# EAGLE board CrackberryPi_1.0.4 (EAGLE 6.5.0)
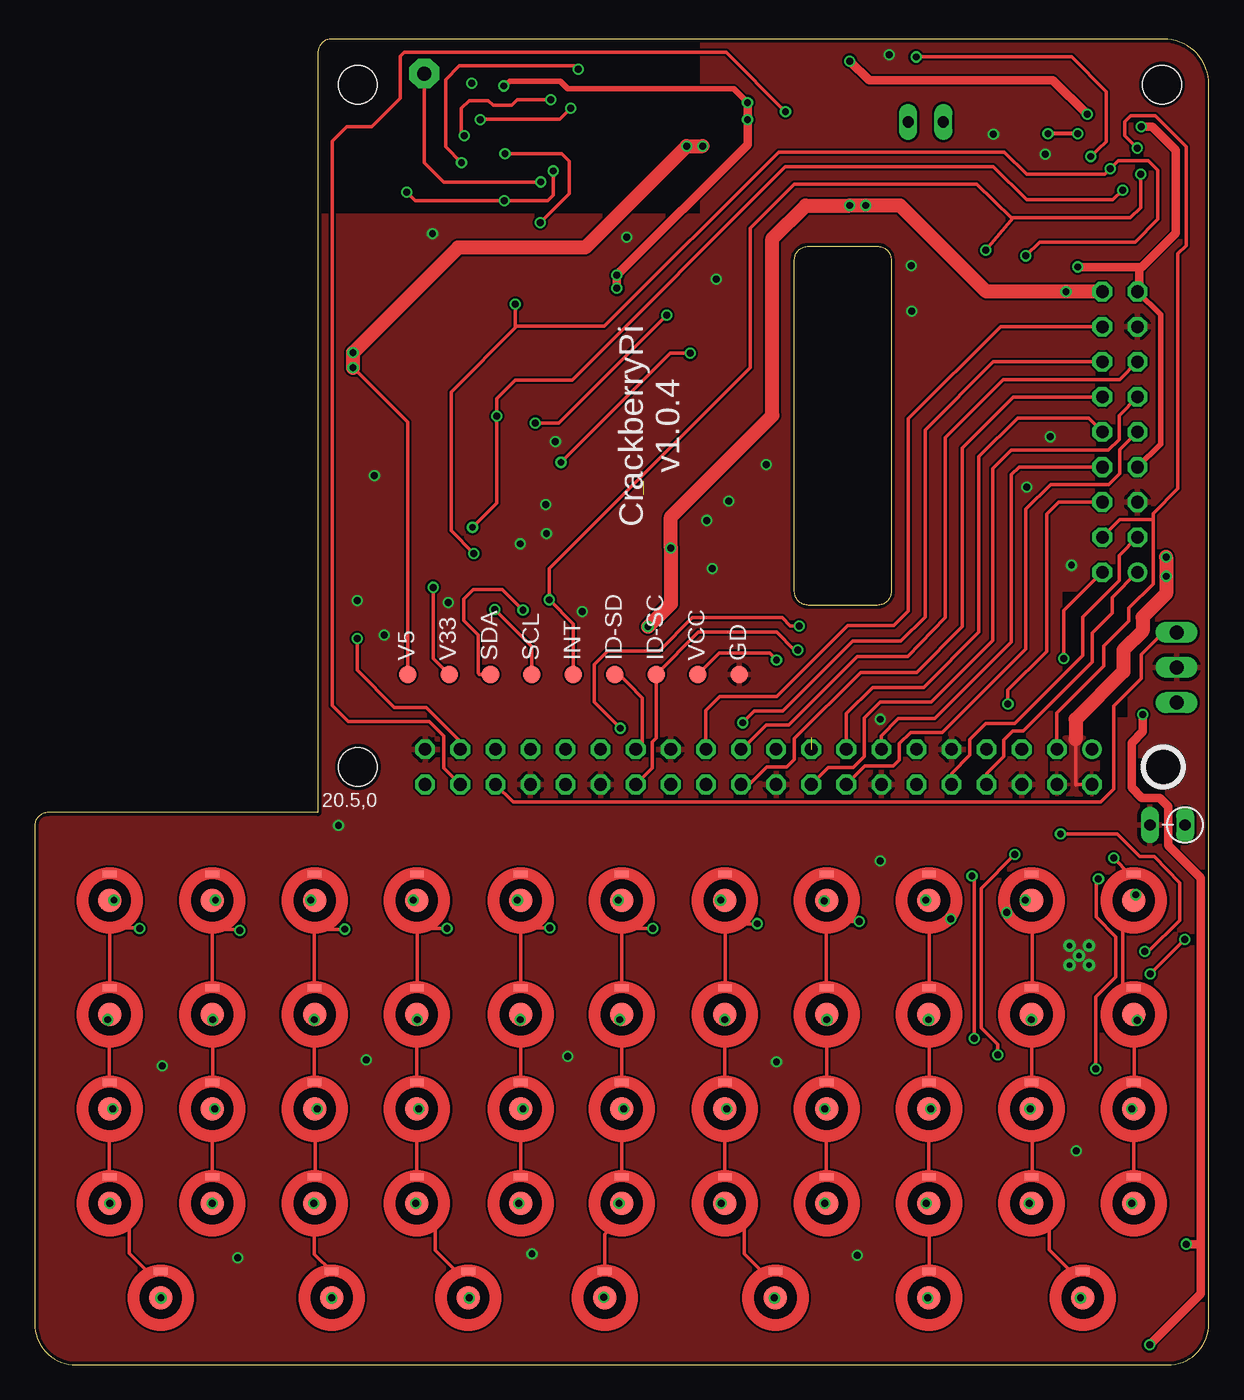
[diagram p5: board, top side]
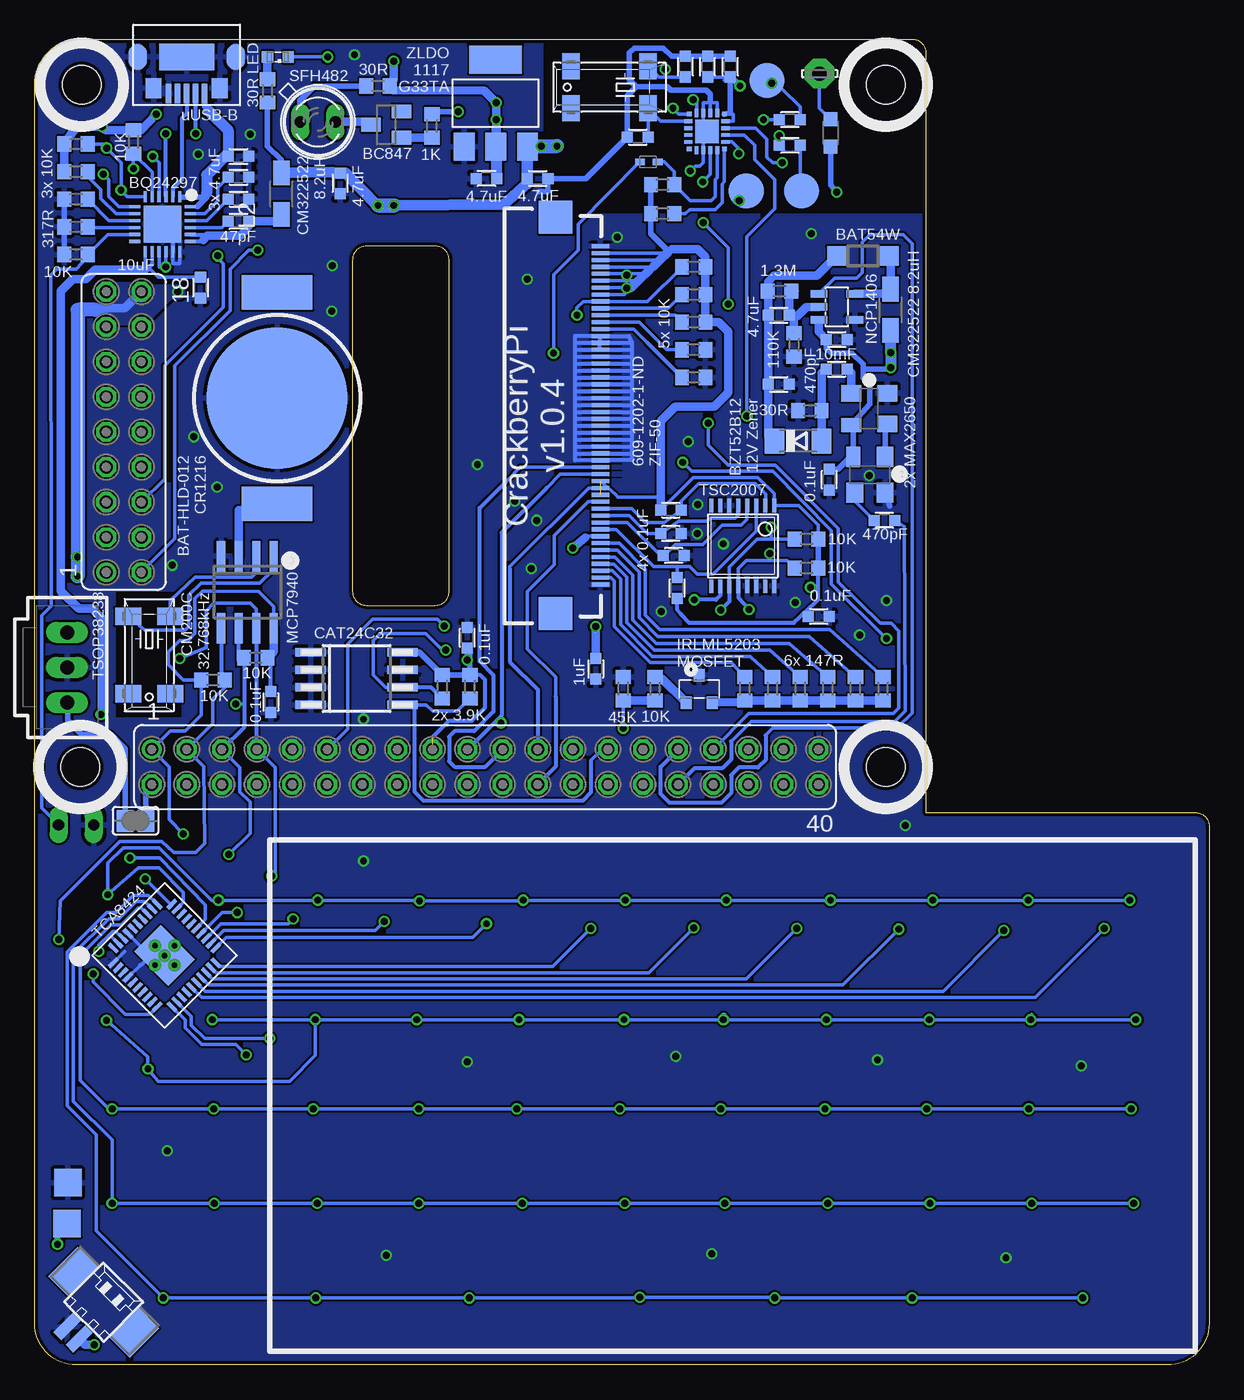
[diagram p6: board, bottom side, seen from below]

Size 85 x 96 mm. Coordinates in mm from the lower left corner, seen from the top.
Outline: 0,39 0,3 arc90 3,0 82,0 arc90 85,3 85,92.7 arc90 81.7,96 21.5,96 arc90 20.5,95 20.5,40 1,40 arc90 0,39
Outline: 56,81 61,81 arc-90 62,80 62,56 arc-90 61,55 56,55 arc-90 55,56 55,80 arc-90 56,81
Copper layers (1*16): Top 0.035mm / dielectric 1.5mm / Bottom 0.035mm
Design rules "SeeedStudio_2layer_DRU_no_angle_20140221": minimum track width 6mil, minimum drill 12mil, track to track 6mil, track to pad 6mil, pad to pad 6mil, via to via 6mil, smd to smd 0mil, copper to edge 10mil, drill to drill 10mil, minimum pad ring 10mil, minimum via ring 6mil, stop-mask expansion 2mil, vias tented up to drill 100mil, thermal gap 10mil
Holes 2.8 mm at 81.7,43.3 81.6,92.7 23.4,92.7 23.4,43.3
bKeepout: area 33,55.7 to 33.2,56.9
tRestrict: area 20.5,83.4 to 48.2,95.7; area 74.4,46.9 to 79.1,56
bRestrict: area 42.5,73.2 to 45.4,73.3; area 42.5,72.7 to 45.4,72.8; area 42.5,72.2 to 45.4,72.3; area 42.5,71.7 to 45.4,71.8; area 42.5,71.2 to 45.4,71.3; area 42.5,70.7 to 45.4,70.8; area 42.5,70.2 to 45.4,70.3; area 42.5,69.7 to 45.4,69.8; area 42.5,69.2 to 45.4,69.3; area 42.5,68.7 to 45.4,68.8; area 42.5,68.2 to 45.4,68.3; area 42.5,67.7 to 45.4,67.8; 14 more areas

## Footprints (pad centres in the part's own frame; a part is rotated, then mirrored left to right if it is on the bottom)
4MM = smd 1.7 x 1.7: IN 0,0 | smd 1 x 0.5: OUT 0,1.9
LSP10 = drill 1.016 pad 2.159 octagon: MP 0,0
B2,54 = smd 2.54 x 2.54: TP 0,0
C0603 = smd 0.8 x 0.8: 1 -0.75,0; 2 0.75,0
SOD123 = smd 1.4 x 1.4: A 1.9,0; C -1.9,0
SOD523 = smd 0.7 x 0.5: A 0.7,0; C -0.6,0
SOD80C = smd 1.4 x 1.8: A 1.7,0; C -1.7,0
SFH482 = drill 0.813 long: A -1.27,0; K 1.27,0
B1,27 = smd 1.27 x 1.27: TP 0,0
SOT223 = smd 1.499 x 2.007: 1 -2.261,-3.15; 2 0.025,-3.15; 3 2.311,-3.15 | smd 3.81 x 2.007: 4 0,3.15
SO-08M = smd 0.6 x 2.2: 1 -1.905,-3.33; 2 -0.635,-3.33; 3 0.635,-3.33; 4 1.905,-3.33; 5 1.905,3.33; 6 0.635,3.33; 7 -0.635,3.33; 8 -1.905,3.33
R1206W = smd 1.8 x 1.2: 1 -1.499,0; 2 1.499,0
L2012C = smd 1 x 1: 1 -1,0; 2 1,0
SML0603 = smd 0.8 x 0.8: A 0.75,0; C -0.75,0
MICRO3 = smd 0.8 x 0.9: 1 -0.95,-1; 2 0.95,-1; 3 0,1
MM20SS = smd 1.27 x 1.88: 1 -2.794,-1.524; 2 2.794,-1.524; 3 2.794,1.524; 4 -2.794,1.524
R0603 = smd 1 x 1.1: 1 -0.85,0; 2 0.85,0
RS-2,5 = drill 0.813 long: 1 -1.27,0; 2 1.27,0
SJ = smd 1.168 x 1.6: 1 -0.762,0; 2 0.762,0
FE20-2 = drill 0.914: 1 -24.13,1.27 | drill 0.914 octagon: 2 -24.13,-1.27; 3 -21.59,1.27; 4 -21.59,-1.27; 5 -19.05,1.27; 6 -19.05,-1.27; 7 -16.51,1.27; 8 -16.51,-1.27; 9 -13.97,1.27; 10 -13.97,-1.27; 11 -11.43,1.27; 12 -11.43,-1.27; 13 -8.89,1.27; 14 -8.89,-1.27; 15 -6.35,1.27; 16 -6.35,-1.27; 17 -3.81,1.27; 18 -3.81,-1.27; 19 -1.27,1.27; 20 -1.27,-1.27; 21 1.27,1.27; 22 1.27,-1.27; 23 3.81,1.27; 24 3.81,-1.27; 25 6.35,1.27; 26 6.35,-1.27; 27 8.89,1.27; 28 8.89,-1.27; 29 11.43,1.27; 30 11.43,-1.27; 31 13.97,1.27; 32 13.97,-1.27; 33 16.51,1.27; 34 16.51,-1.27; 35 19.05,1.27; 36 19.05,-1.27; 37 21.59,1.27; 38 21.59,-1.27; 39 24.13,1.27; 40 24.13,-1.27
FE09-2 = drill 0.914: 1 -10.16,1.27 | drill 0.914 octagon: 2 -10.16,-1.27; 3 -7.62,1.27; 4 -7.62,-1.27; 5 -5.08,1.27; 6 -5.08,-1.27; 7 -2.54,1.27; 8 -2.54,-1.27; 9 0,1.27; 10 0,-1.27; 11 2.54,1.27; 12 2.54,-1.27; 13 5.08,1.27; 14 5.08,-1.27; 15 7.62,1.27; 16 7.62,-1.27; 17 10.16,1.27; 18 10.16,-1.27
SOT23 = smd 1 x 1.4: 1 -0.95,-1.1; 2 0.95,-1.1; 3 0,1.1
TP20SQ = smd 2 x 2: TP 0,0
VQFN-4X4-24 = smd 0.8 x 0.23: 1 -2,1.25; 2 -2,0.75; 3 -2,0.25; 4 -2,-0.25; 5 -2,-0.75; 6 -2,-1.25; 13 2,-1.25; 14 2,-0.75; 15 2,-0.25; 16 2,0.25; 17 2,0.75; 18 2,1.25 | smd 0.23 x 0.8: 7 -1.25,-2; 8 -0.75,-2; 9 -0.25,-2; 10 0.25,-2; 11 0.75,-2; 12 1.25,-2; 19 1.25,2; 20 0.75,2; 21 0.25,2; 22 -0.25,2; 23 -0.75,2; 24 -1.25,2 | smd 2.7 x 2.7: P$1 0,0
SOT23-5L = smd 0.55 x 1.2: 1 -0.95,-1.3; 2 0,-1.3; 3 0.95,-1.3; 4 0.95,1.3; 5 -0.95,1.3
SOT143-W = smd 1.2 x 1.45: 1 -1.1,-1.3; 2 -1.1,1.3; 3 1.1,1.3 | smd 1 x 1.45: 4 1.2,-1.3
CR1216 = smd 2.5 x 5.1: + -7.65,0; P$2 7.65,0 | smd 10.2 x 10.2: GND 0,0
SO08 = smd 0.6 x 2.2: 1 -1.905,-2.6; 2 -0.635,-2.6; 3 0.635,-2.6; 4 1.905,-2.6; 5 1.905,2.6; 6 0.635,2.6; 7 -0.635,2.6; 8 -1.905,2.6
TSSOP16 = smd 0.305 x 0.991: 1 -2.275,-2.918; 2 -1.625,-2.918; 3 -0.975,-2.918; 4 -0.325,-2.918; 5 0.325,-2.918; 6 0.975,-2.918; 7 1.625,-2.918; 8 2.275,-2.918; 9 2.275,2.918; 10 1.625,2.918; 11 0.975,2.918; 12 0.325,2.918; 13 -0.325,2.918; 14 -0.975,2.918; 15 -1.625,2.918; 16 -2.275,2.918
QFN40 = smd 0.85 x 0.28: 1 -3,2.25; 2 -3,1.75; 3 -3,1.25; 4 -3,0.75; 5 -3,0.25; 6 -3,-0.25; 7 -3,-0.75; 8 -3,-1.25; 9 -3,-1.75; 10 -3,-2.25; 21 3,-2.25; 22 3,-1.75; 23 3,-1.25; 24 3,-0.75; 25 3,-0.25; 26 3,0.25; 27 3,0.75; 28 3,1.25; 29 3,1.75; 30 3,2.25 | smd 0.28 x 0.85: 11 -2.25,-3; 12 -1.75,-3; 13 -1.25,-3; 14 -0.75,-3; 15 -0.25,-3; 16 0.25,-3; 17 0.75,-3; 18 1.25,-3; 19 1.75,-3; 20 2.25,-3; 31 2.25,3; 32 1.75,3; 33 1.25,3; 34 0.75,3; 35 0.25,3; 36 -0.25,3; 37 -0.75,3; 38 -1.25,3; 39 -1.75,3; 40 -2.25,3 | smd 2.7 x 3.5: P$2 0,0 | smd 1 x 1.5: P$11 -0.65,0.9; P$12 0.65,0.9; P$13 0.65,-0.9; THERMAL -0.65,-0.9 | drill 0.4 pad 0.406: VIA1 0,1; VIA2 -1,0; VIA3 0,0; VIA4 1,0; VIA5 0,-1
QFN20-3X3 = smd 0.34 x 0.34: 1 -1.27,1.27; 6 -1.27,-1.27; 11 1.27,-1.27; 16 1.27,1.27 | smd 0.61 x 0.28: 2 -1.35,0.75; 3 -1.35,0.25; 4 -1.35,-0.25; 5 -1.35,-0.75; 12 1.35,-0.75; 13 1.35,-0.25; 14 1.35,0.25; 15 1.35,0.75 | smd 0.28 x 0.61: 7 -0.75,-1.35; 8 -0.25,-1.35; 9 0.25,-1.35; 10 0.75,-1.35; 17 0.75,1.35; 18 0.25,1.35; 19 -0.25,1.35; 20 -0.75,1.35 | smd 1.7 x 1.7: P$1 0,0
MICRO_USB = smd 0.4 x 1.4: 1_+5V -1.3,2.65; 2_D- -0.65,2.65; 3_D+ 0,2.65; 4_ID 0.65,2.65; 5_0V 1.3,2.65 | smd 4 x 1.9: GND1 0,0 | smd 1.35 x 1.9: GND2 -3.55,0; GND5 3.55,0 | smd 1.15 x 1.45: P$1 -2.4,2.25; P$7 2.4,2.25
53261-02 = smd 0.8 x 2: 1 0.625,-2.5; 2 -0.625,-2.5 | smd 2.1 x 3: S1 3.125,0.625; S2 -3.125,0.625
70543-03 = drill 1.016 long: 1 -2.54,0; 2 0,0; 3 2.54,0
FH12-50S-0.5SH = smd 1.3 x 0.3: 1 3.95,27.8; 2 3.95,27.3; 3 3.95,26.8; 4 3.95,26.3; 5 3.95,25.8; 6 3.95,25.3; 7 3.95,24.8; 8 3.95,24.3; 9 3.95,23.8; 10 3.95,23.3; 11 3.95,22.8; 12 3.95,22.3; 13 3.95,21.8; 14 3.95,21.3; 15 3.95,20.8; 16 3.95,20.3; 17 3.95,19.8; 18 3.95,19.3; 19 3.95,18.8; 20 3.95,18.3; 21 3.95,17.8; 22 3.95,17.3; 23 3.95,16.8; 24 3.95,16.3; 25 3.95,15.8; 26 3.95,15.3; 27 3.95,14.8; 28 3.95,14.3; 29 3.95,13.8; 30 3.95,13.3; 31 3.95,12.8; 32 3.95,12.3; 33 3.95,11.8; 34 3.95,11.3; 35 3.95,10.8; 36 3.95,10.3; 37 3.95,9.8; 38 3.95,9.3; 39 3.95,8.8; 40 3.95,8.3; 41 3.95,7.8; 42 3.95,7.3; 43 3.95,6.8; 44 3.95,6.3; 45 3.95,5.8; 46 3.95,5.3; 47 3.95,4.8; 48 3.95,4.3; 49 3.95,3.8; 50 3.95,3.3 | smd 2.4 x 2.4: P$1 0.7,1.2; P$2 0.7,29.9

## Placement (x,y rotation side)
0  DOME  [4MM]  72.16,33.63 0 top
1  DOME  [4MM]  5.43,33.63 0 top
2  DOME  [4MM]  12.86,33.63 0 top
3  DOME  [4MM]  20.27,33.63 0 top
4  DOME  [4MM]  27.68,33.63 0 top
5  DOME  [4MM]  35.2,33.63 0 top
6  DOME  [4MM]  42.51,33.63 0 top
7  DOME  [4MM]  49.97,33.63 0 top
8  DOME  [4MM]  57.33,33.63 0 top
9  DOME  [4MM]  64.73,33.63 0 top
!  DOME  [4MM]  64.73,11.71 0 top
(  DOME  [4MM]  72.16,18.55 0 top
)  DOME  [4MM]  79.56,18.55 0 top
+  DOME  [4MM]  79.56,25.39 0 top
,  DOME  [4MM]  72.16,11.71 0 top
-  DOME  [4MM]  79.56,33.63 0 top
.  DOME  [4MM]  79.56,11.71 0 top
?  DOME  [4MM]  57.33,11.71 0 top
@  DOME  [4MM]  64.73,4.87 0 top
A  DOME  [4MM]  5.43,18.55 0 top
ANTENNA  LSP10  [LSP10]  28.2,93.5 0 bottom
AUDIO_L  TPB2,54  [B2,54]  32,93 0 bottom
AUDIO_R  TPB2,54  [B2,54]  29.5,85 0 bottom
B  DOME  [4MM]  35.2,11.71 0 top
C  DOME  [4MM]  20.27,11.71 0 top
C1  [C0603]  67.91,48 270 bottom
C2  [C0603]  38.95,61.9 0 bottom
C3  [C0603]  38.5,56.25 90 bottom
C4  [C0603]  38.95,60.2 180 bottom
C5  [C0603]  53.7,52.65 90 bottom
C6  10mf  [C0603]  26.95,74.25 0 bottom
C7  [C0603]  28.25,54.2 0 bottom
C8  20pF  [C0603]  37.9,94 90 bottom
C9  1mf  [C0603]  44.4,50.4 270 bottom
C10  0.047mF  [C0603]  70.25,82.8 180 bottom
C11  4.7mF  [C0603]  62.9,85.55 270 bottom
C12  4.7mF  [C0603]  70.25,84.4 0 bottom
C13  4.7mF  [C0603]  48.6,85.9 0 bottom
C14  4.7mF  [C0603]  52.3,85.9 180 bottom
C15  10mF  [C0603]  73,78 270 bottom
C16  4.7mF  [C0603]  70.25,87.5 0 bottom
C17  4.7mF  [C0603]  70.25,86 0 bottom
C18  [C0603]  38.75,58.6 180 bottom
C19  4.7mf  [C0603]  31.15,71 0 bottom
C20  68pf  [C0603]  31.15,76 0 bottom
C21  470pf  [C0603]  26.95,72.1 0 bottom
C22  0.1mf  [C0603]  27.5,64.1 90 bottom
C23  470pf  [C0603]  23.5,61.15 180 bottom
C24  20pF  [C0603]  41.35,88.9 0 bottom
C25  0.47uF  [C0603]  30.35,90.15 180 bottom
C26  0.47uF  [C0603]  30.35,88.3 180 bottom
C27  10uF  [C0603]  36.3,94 90 bottom
C28  22nF  [C0603]  34.65,94 90 bottom
D  DOME  [4MM]  20.27,18.55 0 top
D1  [SOD123]  25.05,80.3 0 bottom
D2  BB141  [SOD523]  40.6,87.1 0 bottom
D4  1N759  [SOD80C]  29.75,66.9 0 bottom
D5  SFH482  [SFH482]  64.5,90 0 bottom
E  DOME  [4MM]  20.27,25.39 0 top
F  DOME  [4MM]  27.68,18.55 0 top
FN-RIGHT  DOME  [4MM]  75.86,4.87 0 top
G  DOME  [4MM]  35.2,18.55 0 top
GD  TPB1,27  [B1,27]  51,50 90 top
GND  TPB2,54  [B2,54]  33.5,85 0 bottom
H  DOME  [4MM]  42.51,18.55 0 top
I  DOME  [4MM]  57.33,25.39 0 top
IC1  REG1117  [SOT223]  51.65,91.35 0 bottom
IC2  24C02CSM  [SO-08M]  61.7,49.7 270 bottom
ID-SC  TPB1,27  [B1,27]  45,50 90 top
ID-SD  TPB1,27  [B1,27]  42,50 90 top
INT  TPB1,27  [B1,27]  39,50 90 top
J  DOME  [4MM]  49.97,18.55 0 top
K  DOME  [4MM]  57.33,18.55 0 top
L  DOME  [4MM]  64.73,18.55 0 top
L1  8.2mH  [R1206W]  23.05,76.4 90 bottom
L2  8.2mH  [R1206W]  67.15,84.8 90 bottom
L3  120nH  [L2012C]  27.4,89.2 90 bottom
LED1  [SML0603]  67.4,94.7 180 bottom
M  DOME  [4MM]  49.97,11.71 0 top
N  DOME  [4MM]  42.51,11.71 0 top
O  DOME  [4MM]  64.73,25.39 0 top
P  DOME  [4MM]  72.16,25.39 0 top
Q  DOME  [4MM]  5.43,25.39 0 top
Q1  IRLML5203  [MICRO3]  36.9,48.95 0 bottom
Q2  32.768  [MM20SS]  43.4,92.5 180 bottom
Q3  [MM20SS]  76.72,51.4 270 bottom
R  DOME  [4MM]  27.68,25.39 0 top
R1  10k  [R0603]  69,51.2 0 bottom
R2  10k  [R0603]  29.15,59.8 0 bottom
R3  10k  [R0603]  72.1,49.6 180 bottom
R4  3.9K  [R0603]  55.5,49.1 90 bottom
R5  3.9K  [R0603]  53.5,49.1 90 bottom
R6  10k  [R0603]  29.15,57.7 0 bottom
R7  THERMISTOR-2,5  [RS-2,5]  82,39.1 180 top
R8  317  [R0603]  82,82.4 180 bottom
R9  10k  [R0603]  82,88.4 0 bottom
R10  10k  [R0603]  77.85,88.55 270 bottom
R11  10k  [R0603]  39.55,85.45 0 bottom
R12  30  [R0603]  68.15,92.25 90 bottom
R13  10k  [R0603]  37.3,79.5 0 bottom
R14  10k  [R0603]  37.3,77.5 0 bottom
R15  10k  [R0603]  37.3,75.5 0 bottom
R16  10k  [R0603]  37.3,73.5 180 bottom
R17  10k  [R0603]  37.3,71.5 180 bottom
R18  147  [R0603]  23.6,48.95 90 bottom
R19  147  [R0603]  25.6,48.95 90 bottom
R20  147  [R0603]  27.6,48.95 90 bottom
R21  147  [R0603]  29.6,48.95 90 bottom
R22  147  [R0603]  31.6,48.95 90 bottom
R23  147  [R0603]  33.6,48.95 90 bottom
R24  10k  [R0603]  40.1,48.95 270 bottom
R25  45k  [R0603]  42.4,48.95 270 bottom
R26  10k  [R0603]  82,80.4 180 bottom
R27  10k  [R0603]  82,84.4 0 bottom
R28  10k  [R0603]  82,86.4 0 bottom
R29  10k  [R0603]  39.55,83.35 0 bottom
R36  1.3m  [R0603]  31.1,77.75 180 bottom
R37  110k  [R0603]  30.05,73.85 90 bottom
R38  30  [R0603]  28.9,69.1 0 bottom
R39  30  [R0603]  60.15,92.6 0 bottom
R40  1k  [R0603]  56.25,89.7 90 bottom
S  DOME  [4MM]  12.86,18.55 0 top
SCL  TPB1,27  [B1,27]  36,50 90 top
SDA  TPB1,27  [B1,27]  33,50 90 top
SHIFT-RIGHT  DOME  [4MM]  53.62,4.87 0 top
SHILFT-LEFT  DOME  [4MM]  9.14,4.87 0 top
SJ2  [SJ]  77.7,39.4 180 bottom
SPACE1  DOME  [4MM]  21.5,4.87 0 top
SPACE2  DOME  [4MM]  31.39,4.87 0 top
SPACE3  DOME  [4MM]  41.27,4.87 0 top
SV1  [FE20-2]  52.4,43.3 0 bottom
SV3  [FE09-2]  78.55,67.55 90 bottom
T  DOME  [4MM]  35.2,25.39 0 top
T1  BC847  [SOT23]  59.55,89.8 90 bottom
TP1  TPTP20SQ  [TP20SQ]  82.65,10.25 270 bottom
TP2  TPTP20SQ  [TP20SQ]  82.6,13.2 0 bottom
U  DOME  [4MM]  49.97,25.39 0 top
U$1  BQ24297  [VQFN-4X4-24]  75.75,82.6 270 bottom
U$2  NCP1406  [SOT23-5L]  26.95,76.6 270 bottom
U$3  MAX2650  [SOT143-W]  24.6,69.25 270 bottom
U$4  CR1216  [CR1216]  67.45,70 90 bottom
U$5  MCP7940N  [SO08]  69.6,55.95 180 bottom
U$6  TSC2007  [TSSOP16]  33.75,59.3 180 bottom
U$7  TCA8424  [QFN40]  75.6,29.65 45 bottom
U$8  SI4713  [QFN20-3X3]  36.35,89.3 90 bottom
U$9  MICRO_USB  [MICRO_USB]  74,94.7 180 bottom
U$10  MAX2650  [SOT143-W]  24.55,64.45 180 bottom
V  DOME  [4MM]  27.68,11.71 0 top
V5  TPB1,27  [B1,27]  27,50 90 top
V33  TPB1,27  [B1,27]  30,50 90 top
VCC  TPB1,27  [B1,27]  48,50 90 top
W  DOME  [4MM]  12.86,25.39 0 top
X  DOME  [4MM]  12.86,11.71 0 top
X1  53261-02  [53261-02]  80.45,4.1 315 bottom
X3  C-GRID-03-70543  [70543-03]  82.65,50.5 270 bottom
X5  FH12-50S-0.5SH  [FH12-50S-0.5SH]  48,53.2 0 bottom
Y  DOME  [4MM]  42.51,25.39 0 top
Z  DOME  [4MM]  5.43,11.71 0 top

## Tracks (layer width: path | path; a pad name or v marks a point on that pad's centre or on a via)
+3V3  (via drill 0.5)  (1 unrouted)
  Top 0.254: v28.85,56.3 28.85,51.15 V33.TP
  Top 0.406: v33.95,92.6 34.4,92.95 38.05,92.95 38.6,92.4 50.6,92.4 v51.6,91.4 | SV3.17 81.5,76.03 81.5,66.69 SV3.7
  Top 0.61: v59,94.4 60.4,93 73.7,93 v76.2,90.55 | v51.6,91.4 v51.6,90.15 51.6,88.35 v42.15,78.9 v42.15,77.95 | v75.5,79.5 77.3,79.5 | 77.3,79.5 79.95,79.5 | 79.95,79.5 80.15,79.5 82.6,81.95 82.6,87.95 80.9,89.65 v80.1,89.65 | 77.28,79.48 77.3,79.5 | SV3.17 79.95,77.84 79.95,79.5
  Bottom 0.254: C2.1 39.9,61.7 | U$1.16 75.5,79.65 76,79.65 U$1.15 76,79.5 v75.5,79.5 | U$8.11 34.45,90.57 34.45,90.05 U$8.10 | 39.8,62 C2.1 | X5.35 42.95,63 42.8,62.85 39.7,62.85 | R2.2 28.3,60.8 29.72,62.22 U$6.1 31.48,63.08 32.65,64.25 37.35,64.25 C2.1 | C7.1 28.96,54.76 28.5,55.21 | C27.1 C28.1 | 35.08,93.02 34.55,93.02 34.37,93.02 | v28.85,56.3 28.3,56.3 | 40.23,79.5 40.23,79.53 | 42.25,78 v42.15,77.95 42.2,78 X5.7 | 41.28,78.37 41.28,78.53 | X5.8 42.31,77.5 41.68,78.13 | X5.6 41.55,78.5 41.43,78.38 | X5.5 41.05,79 40.95,78.9 40.75,78.95 40.47,79.23 40.47,79.3 40.67,79.5 X5.4 | X5.3 39.86,80 39.8,79.94 | X5.2 39.55,80.5 39.27,80.78
  Bottom 0.305: R6.2 28.3,56.3 28.3,55.4 28.5,55.21 30.05,53.75 37.65,53.75 38.2,54.35 38.5,54.7 C3.1
  Bottom 0.406: 28.25,59.75 R2.2 R6.2 | 82.85,86.35 R28.1 | 39.1,80.6 39.27,80.78 40.4,81.9 R29.1 R11.1 | v33.95,92.6 34.45,93.1 | 34.45,93.1 C28.1 34.65,90.65 U$8.11 | 34.45,93.1 34.53,93.02 34.55,93.02
  Bottom 0.61: v59,94.4 59,93.05 R39.2 59.1,92.3 52.45,92.25 v51.6,91.4 v51.6,90.15 | 82.85,86.35 R9.1 82,89.65 v80.1,89.65 79.85,89.4 R10.1 77.3,89.4 v76.2,90.55 | v51.6,90.15 51.58,89.12 | IC1.2 51.62,89.12 v51.6,90.15 | C2.1 39.7,62.85 39.7,68.35 38.65,69.4 35.8,69.4 34.8,70.4 34.8,74.8 35.5,75.5 R15.2 R14.2 R13.2 36.45,80.25 37,80.8 38.9,80.8 39.1,80.6 39.8,79.94 40.23,79.53 40.47,79.3 41.28,78.53 41.43,78.38 41.68,78.13 41.86,77.95 v42.15,77.95
  Bottom 0.813: C14.1 51.55,88.13 IC1.2
+5V  (via drill 0.5)
  Top 0.254: 75.3,45.35 75.35,45.3 75.35,42 75.38,42.03 SV1.2 | V5.TP 27,68.25 v23.05,72.2
  Top 1.016: v23.05,72.2 v23.05,73.3 30.65,80.9 39.85,80.9 v47.2,88.25 v48.35,88.25 | SV3.18 68.89,77.71 62.65,83.95 v60.15,83.95 v59,83.95 55.8,83.95 53.4,81.55 53.4,68.75 46.05,61.4 v46.05,59.15 46.05,55.1 v44.4,53.45 | v81.9,58.5 81.9,55.85 80.2,54.15 80.2,53.15 78.8,51.75 78.8,50.2 75.35,46.75 75.35,45.3
  Bottom 0.254: SJ2.2 SJ2.1 | 45.15,59.9 45.25,59.65 44.9,60 X5.43
  Bottom 0.305: 58.95,83.95 60.75,84.45 60.9,84.6 60.85,84.6 v60.15,83.95
  Bottom 0.406: C6.1 27.7,73.6 27.35,73.25 25.85,73.25 25.05,72.45 25.05,72.1 | R12.1 68.15,88.25 67.15,87.25 L2.2 | 25.05,72.1 25.05,71.45 24.55,70.95 24.55,69.55 U$3.4 25.75,67.9 U$10.4 25.95,65.75 26.85,64.85 C22.2 | SJ2.1 76.96,41.66 SV1.2 | v23.05,72.2 23.15,72.1 25.05,72.1 | SJ2.2 78.46,44.61 79.5,45.65 81.6,45.65 82.6,46.65 82.6,47.91 X3.3
  Bottom 0.61: C6.1 28.25,74.8 U$2.3 | C11.1 63.45,86.35 | C9.1 v44.4,53.45 | 45.15,59.9 v46.05,59.15 | SV3.18 78.49,76.5 80.1,76.5 79.9,76.45 80.6,76.4
  Bottom 0.813: 63.45,86.35 L2.2 | IC1.3 49.34,86.11 | 49.34,86.11 C13.1 49.35,88.25 | v23.05,72.2 v23.05,73.3 L1.1 | 49.34,86.11 49.34,85.51 51.05,84 v59,83.95 | 58.95,83.95 60.2,83.95 62.5,86.3 C11.1
  Bottom 1.016: 49.35,88.25 v47.2,88.25 | v59,83.95 v60.15,83.95 58.95,83.95 | 80.6,76.4 81.9,76.4 v81.9,58.5 v81.9,57.1
  other vias: 74.65,77.7
  pour Top: 73.6,41.3 76.95,41.25 77,44.9 75.9,45.45 74.6,45.45 73.65,45
  pour Bottom: 77,78.3 79.15,78.3 80.25,77.2 80.25,76.45 79.2,75.4 77,75.4 75.15,77.25 74.6,77.25 arc-90 74.2,77.65 arc-90 74.65,78.1 76.85,78.1
+15V
  Bottom 0.61: D4.C 31.9,67.2 C19.1 C20.1 31.9,77.45 | 31.9,77.45 R36.2 | 31.9,77.45 31.9,78.45 31.5,78.85 28.4,78.85 D1.C
AUDIO_L  (via drill 0.5)
  Bottom 0.254: 31.45,93 30.9,92.35 | 30.9,92.35 v31.65,92.8 32,92.2 | C25.1 29.6,91.1 30.9,92.35
  Bottom 0.406: v31.65,92.8 31.65,93 AUDIO_L.TP
AUDIO_R
  Bottom 0.254: C26.1 29.6,85.1 AUDIO_R.TP
BASE
  Bottom 0.61: T1.1 R40.1
CE0
  Bottom 0.254: 47.3,48.4 47.3,49.8 49.35,51.85 49.35,56 47.4,57.95 47.4,60.05 44.95,62.5 X5.38
  Bottom 0.305: 47.3,48.4 47.3,43.32 SV1.24
COL0  (via drill 0.5)
  Top 0.254: 1.IN 5.73,33.63 v5.75,33.65 | v13.1,33.65 12.84,33.65 2.IN | 3.IN 20.02,33.63 v20,33.65 | 4.IN 27.42,33.63 v27.4,33.65 | 5.IN 34.97,33.63 v34.95,33.65 | 6.IN 42.27,33.63 v42.25,33.65 | 7.IN 49.67,33.63 v49.65,33.65 | 8.IN 57.18,33.63 v57.15,33.6 | 9.IN 64.52,33.63 v64.5,33.65 | 0.IN 71.92,33.63 v71.7,33.65 | -.IN 80.27,33.63 v79.7,34.05
  Bottom 0.254: v5.75,33.65 v13.1,33.65 v20,33.65 20.02,33.63 3.IN 20.29,33.65 v27.4,33.65 27.42,33.63 4.IN 27.7,33.65 v34.95,33.65 v42.25,33.65 42.27,33.63 6.IN 42.52,33.65 v49.65,33.65 49.7,33.6 v57.15,33.6 57.18,33.63 8.IN 57.34,33.65 v64.5,33.65 64.52,33.63 9.IN 64.75,33.65 v71.7,33.65 72.2,33.65 76,37.45 78.6,37.45 79.7,36.35 v79.7,34.05 77.5,36 76,36 74.25,34.2 74.25,33.48 U$7.29
COL1  (via drill 0.5)
  Top 0.254: Q.IN 5.6,25.39 v5.3,25 | v12.9,25 W.IN | E.IN 20.3,24.99 20.3,25.05 | 27.55,25.39 R.IN 27.7,25.02 v27.7,25 | 27.55,25.39 v27.7,25 | T.IN 35.05,25.39 v35.15,25 | Y.IN 42.35,25.39 v42.35,25 | U.IN 49.8,25.39 v49.95,25 | I.IN 57.16,25.39 v57.35,25 | O.IN 64.59,25.39 v64.7,25 | P.IN 72.01,25.39 v72.15,25 | +.IN 80.3,25.39 v79.8,24.95 | v76.8,21.45 76.8,26.65 78.25,28.1 78.25,31 76.85,32.45 76.85,34.9 v77,35.2 | 20.1,25 v20.25,25 | v20.25,25 20.3,25.05 | 20.3,25.05 20.35,25 v20.25,25 | 27.55,25.39 27.6,25.34 27.6,25 v27.7,25
  Bottom 0.254: v5.3,25 v12.9,25 | v12.9,25 W.IN | v27.7,25 v35.15,25 35.05,25.39 T.IN 35.2,25 v42.35,25 v42.35,24.99 42.51,24.99 42.66,25 v49.95,25 49.94,25.04 50.06,25.04 50.17,25 v57.35,25 v64.7,25 | v27.7,25 v12.9,25 | v64.7,25 64.79,24.94 64.78,24.99 65.19,25 v72.15,25 | U$7.30 75.12,33.32 v77,35.2 | v79.8,24.95 76.8,22.3 v76.8,21.45 76.05,20.55 66.55,20.55 64.7,22.4 v64.7,25 | v20.25,25 v27.7,25
COL2  (via drill 0.5)
  Top 0.254: SHILFT-LEFT.IN 9.28,4.87 arc-90 v9.15,4.85 | v21.5,4.85 21.52,4.85 SPACE1.IN | SPACE2.IN 31.27,4.87 v31.45,4.85 | SPACE3.IN 41.23,4.87 v41.2,4.9 | SHIFT-RIGHT.IN 53.57,4.87 v53.55,4.85 | @.IN 64.67,4.87 v64.65,4.85 | FN-RIGHT.IN 75.72,4.87 v75.7,4.85
  Bottom 0.254: v75.7,4.85 v64.65,4.85 v53.55,4.85 41.25,4.85 v41.2,4.9 31.41,4.9 SPACE2.IN 31.43,4.87 v31.45,4.85 v21.5,4.85 v9.15,4.85 | U$7.31 76.77,34 77.85,34 79.1,32.75 79.8,32.75 82.65,29.9 82.65,18.75 80.55,16.65 80.55,9.7 v75.7,4.85 | FN-RIGHT.IN 75.72,4.87 v75.7,4.85
COL3  (via drill 0.5)
  Top 0.254: Z.IN 5.25,11.7 v5.45,11.7 | v12.85,11.7 13.49,11.71 X.IN | C.IN 20.25,11.7 v20.2,11.7 | V.IN 27.66,11.7 v27.6,11.7 | B.IN 35.19,11.7 v35.05,11.7 | N.IN 42.49,11.7 v42.3,11.7 | M.IN 49.95,11.7 v49.7,11.7 | ?.IN v57.2,11.71 v57.2,11.7 | !.IN v64.55,11.71 v64.55,11.7 | ,.IN v72,11.71 v72,11.7 | ..IN v79.4,11.71 v79.4,11.7
  Bottom 0.254: v5.45,11.7 v12.85,11.7 v20.2,11.7 20.25,11.7 C.IN v27.59,11.71 v27.6,11.7 27.66,11.7 V.IN v35.04,11.71 v35.05,11.7 v42.3,11.7 42.49,11.7 N.IN 49.15,11.71 | v49.7,11.7 v49.69,11.71 49.15,11.71 | 49.15,11.71 49.15,11.7 v57.2,11.7 v64.55,11.7 v72,11.7 v79.4,11.7 | U$7.32 77.03,33.55 77.65,33.55 78.9,32.3 79.65,32.3 82.2,29.75 82.2,19.1 79.4,16.3 v79.4,11.7 | ..IN v79.41,11.71 v79.4,11.7
COL4  (via drill 0.5)
  Top 0.254: ).IN v79.4,18.55 | v72.05,18.55 (.IN | L.IN v64.85,18.55 | K.IN v57.2,18.55 | J.IN v50.1,18.55 | H.IN v42.65,18.55 | G.IN v35.35,18.55 | F.IN v27.8,18.55 | D.IN v20.45,18.55 | S.IN v13.05,18.55 | A.IN v5.65,18.55
  Bottom 0.254: v5.65,18.55 v13.05,18.55 v20.45,18.55 v27.8,18.55 v35.35,18.55 v42.65,18.55 v50.1,18.55 v57.2,18.55 v64.85,18.55 v72.05,18.55 v79.4,18.55 79.65,18.55 81.7,20.6 81.7,29.65 79.5,31.85 78.75,31.85 77.5,33.1 77.28,33.1 U$7.33
COLLECTOR
  Bottom 0.61: T1.3 60.75,90 D5.K
D+
  Bottom 0.305: U$9.3_D+ 74,90.6 74.35,90.25 74.35,85.8 75,85.15 U$1.2
D-  (via drill 0.5)
  Top 0.305: v75.5,89.15 v73.35,89.15
  Bottom 0.305: U$1.3 v75.5,89.15 | v73.35,89.15 U$9.2_D-
DE
  Bottom 0.254: 40.65,74 41.65,75 X5.13
  Bottom 0.305: R17.2 40.65,74
DISPLAY_RESET  (via drill 0.5)
  Top 0.254: v36.25,68.2 37.95,68.2 v45.75,76
  Bottom 0.254: SV1.33 33.31,47.15 22.85,47.15 22.45,47.55 22.45,53.15 23,53.7 23.8,53.7 26.85,56.7 26.85,60.55 31.4,65.15 34.8,65.15 36.25,66.6 v36.25,68.2 | v45.75,76 45.75,76.55 45.3,77 X5.9 40.65,77 R13.1
FB
  Bottom 0.61: 30.4,77.5 R36.1 | C20.2 30.05,76 R37.2 | R36.1 30,77.75 | U$2.2 29.15,76.6 29.8,75.95 30.35,75.95 C20.2 | C20.2 30.4,77.35 R36.1
FM_RST  (via drill 0.5)
  Top 0.254: SV1.37 30.81,45.14 28.35,47.6 26.05,47.6 23.35,50.3 v23.35,52.6 | v38.1,65.35 46,73.25 v47.45,73.25
  Bottom 0.254: v23.35,52.6 27.35,56.55 27.35,60.4 31.6,64.7 37.45,64.7 v38.1,65.35 | D2.C 45.65,82.6 45.65,80.7 47.45,78.95 v47.45,73.25
GND  (via drill 0.5)
  Top 0.254: v37.55,86.45 37.55,84.7 37.15,84.3 v34,84.3 27.55,84.3 v26.95,84.9
  Bottom 0.254: U$1.18 74.5,79.75 75,79.75 U$1.17 | U$7.4 77.37,28.94 | U$7.1 78.48,29.95 | U$7.THERMAL 75.42,28.57 76.8,29.95 76.96,29.95 U$7.37 | U$8.12 35.6,91.4 36.1,91.4 | 36.1,91.4 36.6,91.4 U$8.14 36.6,89.55 U$8.P$1 36.6,89.3 U$8.3 36.6,87.05 36.85,86.8 37.2,86.8 v37.55,86.45 | U$8.13 36.1,91.4 | GND.TP 34.2,84.3 v34,84.3 | 45.9,65.5 44,65.5
  Bottom 0.305: 44.1,73.5 X5.14 | X5.14 42,74.5 41.8,74 | 41.8,74 41.8,73.5 | 41.8,73.5 41.8,73 | 41.8,73 41.8,72.5 | 41.8,72.5 41.8,72 | 41.8,72 41.8,71.5 | 41.8,71.5 41.8,71 | 41.8,71 41.8,70.5 | 41.8,70.5 41.8,70 | 41.8,70 41.8,69.5 | 41.8,68.5 41.8,68 | 41.8,68 41.8,67.5 | 41.8,67.5 41.8,67 | 41.8,67 41.8,66.5 | 41.8,66.5 41.8,66 | 41.8,66 41.8,65.5 44,65.5 X5.32 | 41.8,66 X5.31 45.9,66 | 41.8,66.5 X5.30 45.9,66.5 | 41.8,67 X5.29 45.9,67 | 41.8,67.5 X5.28 45.9,67.5 | 41.8,68 X5.27 45.9,68 | 41.8,68.5 X5.26 45.9,68.5 | 41.8,69.5 X5.24 45.9,69.5 | 41.8,69.5 41.8,69 | 41.8,69 X5.25 45.9,69 | 41.8,69 41.8,68.5 | 41.8,70 X5.23 45.9,70 | 41.8,70.5 X5.22 45.9,70.5 | 41.8,71 X5.21 45.9,71 | 41.8,71.5 X5.20 45.9,71.5 | 41.8,72 X5.19 45.9,72 | 41.8,72.5 X5.18 45.9,72.5 | 41.8,73 X5.17 45.9,73 | 41.8,74 X5.15 45.9,74 | 41.8,73.5 X5.16 45.9,73.5 | X5.14 45.9,74.5 45.9,74 | 45.9,74 45.9,73.5 | 45.9,73.5 45.9,73 | 45.9,73 45.9,72.5 | 45.9,72.5 45.9,72 | 45.9,72 45.9,71.5 | 45.9,71.5 45.9,71 | 45.9,71 45.9,70.5 | 45.9,70.5 45.9,70 | 45.9,70 45.9,69.5 | 45.9,69.5 45.9,69 | 45.9,69 45.9,68.5 | 45.9,68.5 45.9,68 | 45.9,68 45.9,67.5 | 45.9,67.5 45.9,67 | 45.9,67 45.9,66.5 | 45.9,66.5 45.9,66 | 45.9,66 45.9,65.5 | U$1.P$1 75,81.85 U$1.17 | 77.37,28.94 77.31,28.94 76.31,29.94 U$7.VIA1
  Bottom 0.406: 23.1,62.2 U$10.2 | R26.2 R8.2 R27.1 | R38.1 29.4,69.45 | 41.45,92.55 42.1,91.9 C24.1 45.1,85.9 C13.2 47.85,84.95 48.5,84.95 | 41.45,92.55 39.2,92.55 38.95,92.3 36.4,92.3 36.1,92 36.1,91.4 | C28.2 C27.2 | C27.2 C8.2 | C27.2 38.9,94.75 39.5,95.35 41.6,95.35 41.95,95 41.95,93.05 41.45,92.55 | L3.1 27.4,85.4 v26.95,84.9
  other vias: 75.05,57.9 37.05,60.2 35.15,59.45 37,62.3 22,39.05 28.8,81.9 29.95,55.2 24.6,64.4 25.3,52.85 23.35,55.35 73.5,67.2 71.8,63.55 61.2,46.75 63.45,79.6 49.05,57.65 48.65,61.15 50.25,62.55 37.7,66.85 73.15,87.65 63.5,76.3 52.95,65.2 9.25,21.65 24,22.1 38.6,22.35 53.7,21.95 61.2,36.5 75.4,15.5 59.55,7.95 36,8.05 14.7,7.75 39.65,54.55 49.35,78.6 42.85,81.65 61.85,94.85 69.4,89.1
  pour Bottom (rank 2): 0,39 0,3 arc90 3,0 82,0 arc90 85,3 85,92.6 arc90 81.6,96 21.36,95.9 arc90 20.5,95.04 20.5,40 1,40 arc90
  pour Top (rank 2): 0,39 0,3 arc90 3,0 82,0 arc90 85,3 85,92.6 arc90 81.6,96 21.5,96 arc90 20.5,95 20.5,40 1,40 arc90
GPIO22
  Top 0.254: SV1.15 58.75,47.15 60.65,49.05 64.35,49.05 68.35,53.05 68.35,65.75 71.15,68.55 76.28,68.55 SV3.10
GPIO23
  Top 0.254: SV1.16 60.07,43.35 62.15,43.35 62.6,43.8 62.6,45 63.4,45.8 65.7,45.8 71.75,51.85 71.75,61.95 73.55,63.75 77.75,63.75 78.55,64.55 78.55,66.28 SV3.9
GPIO24
  Top 0.254: SV3.11 78.5,68.72 78.5,67 77.7,66.25 70.7,66.25 69.35,64.9 69.35,52.45 64.9,48 61.2,48 60.05,46.85 60.05,44.05 59.25,43.25 57.43,43.25 SV1.18
GPIO25
  Top 0.254: SV1.22 51.73,42.03 53,43.3 54.45,43.3 55,43.85 55,45.35 59.8,50.15 63.85,50.15 67.15,53.45 67.15,66.4 70.84,70.09 SV3.12
GPIO27
  Top 0.254: SV1.13 61.29,45.54 62.5,46.8 65.15,46.8 70.7,52.35 70.7,64.45 71.25,65 SV3.8
H_SYNC
  Bottom 0.254: R15.1 38.65,76 X5.11
ID_SC  (via drill 0.5)
  Top 0.254: SV1.28 44.7,43.22 44.7,45.1 45,45.4 ID-SC.TP 48.05,53.05 53.7,53.05 55,51.75 v55.25,51.75
  Bottom 0.254: IC2.6 58.38,49.05 59.6,49.05 60.5,49.95 60.5,52.45 60,52.95 56.7,52.95 55.5,51.75 | 55.5,51.75 55.55,51.75 | 55.5,51.75 v55.25,51.75
  Bottom 0.305: R4.1 56.31,49.06 IC2.6
ID_SD
  Top 0.254: ID-SD.TP 42,50.35 44,48.3 44,45.06 SV1.27
  Bottom 0.254: SV1.27 43.93,44.57 44.75,43.75 | R5.1 54.4,47.35 56.2,47.35 56.65,47.8 57.85,47.8 IC2.5
  Bottom 0.305: 44.75,43.75 44.75,41.45 45.35,40.85 56.85,40.85 57.5,41.5 57.5,47.45 57.85,47.8
IN_1
  Bottom 0.61: U$3.1 25.9,71.85 C21.2
INT  (via drill 0.5)
  Top 0.254: 70.85,83.05 70.7,83.05 68.2,85.5 55,85.5 51.8,82.3 51.8,72.2 37.25,57.65 v37.25,55.4 39,53.65 INT.TP | 70.85,83.05 79.3,83.05 80.05,83.8 v80.05,86.2 | v67.85,35.4 68,35.25 v68,23.65 | v74.5,51.15 74.5,54.61 SV3.2 | v68.85,80.7 70.85,83.05
  Bottom 0.254: U$1.7 78.9,83.85 79.65,84.6 79.65,85.8 v80.05,86.2 | U$7.12 73.65,25.23 73.65,24.6 72.7,23.65 v68,23.65 | v67.85,35.4 67.6,35.65 67.6,43.26 SV1.7 | 68.97,52.85 68.97,54.72 69.4,55.15 72.05,55.15 72.6,54.6 72.6,51.95 v74.5,51.15 | SV3.2 74.85,59.82 74.85,72.35 70.85,76.35 70.85,79.35 69.5,80.7 v68.85,80.7
  Bottom 0.305: U$5.7 68.97,52.85 68.97,44.62 SV1.7 | U$6.10 35.38,55.73 35.7,55.4 v37.25,55.4
IR_RX
  Top 0.254: X3.1 81.69,53.04 80.1,51.45 80.1,49.7 78.1,47.7 78.1,41.7 77.15,40.75 34.63,40.75 SV1.36
IR_TX  (via drill 0.5)
  Top 0.254: SV1.38 29.6,43.24 29.6,45.55 28.55,46.6 22.7,46.6 21.55,47.75 21.55,88.6 22.6,89.65 24.4,89.65 26.45,91.7 26.45,94.75 26.75,95.05 50.05,95.05 v54.35,90.75
  Bottom 0.406: R40.2 56.05,90.75 v54.35,90.75
LEDK1
  Bottom 0.254: R18.2 27.45,53.25 39.75,53.25 40.8,54.3 40.8,57.6 42.7,59.5 X5.44
  Bottom 0.305: 23.85,49.8 R18.2
LEDK2
  Bottom 0.254: R19.2 28.95,52.75 39.9,52.75 41.25,54.1 41.25,57.4 42.85,59 X5.45
LEDK3
  Bottom 0.254: R20.2 30.4,52.25 40,52.25 41.7,53.95 41.7,57.2 43,58.5 X5.46
LEDK4
  Bottom 0.254: R21.2 31.8,51.75 40.15,51.75 42.15,53.75 42.15,57.05 43.1,58 X5.47
LEDK5
  Bottom 0.254: R22.2 33.2,51.3 40.3,51.3 42.6,53.6 42.6,56.9 43.2,57.5 X5.48
LEDK6
  Bottom 0.254: R23.2 34.6,50.85 40.45,50.85 43.05,53.45 43.05,56.75 43.3,57 X5.49
LX
  Bottom 0.61: D1.A 23.05,79.95 L1.2 23.1,77.55 U$2.5
MISO
  Top 0.254: SV3.13 78.54,71.35 70.1,71.35 65.9,67.15 65.9,54.1 63.2,51.3 59.55,51.3 54.6,46.35 52.95,46.35 51.17,44.57 SV1.21
  Bottom 0.254: X5.33 49.85,65 50.85,64
  Bottom 0.305: SV1.21 52.4,43.3 54.6,43.3 55,43.7 55,45.5 54.6,45.9 53.2,45.9 51.8,47.3 51.8,49.95 52.8,50.95 52.8,62.05 50.85,64
MOSI  (via drill 0.5)
  Top 0.254: 77.25,72.6 SV3.14 69.38,72.63 64.45,67.7 64.45,54.15 62.7,52.4 59.2,52.4 54.15,47.35 52.1,47.35 v51.25,46.5
  Bottom 0.254: v51.25,46.5 51.2,47.05 | 47.95,63.5 46.95,64.5 X5.34
  Bottom 0.305: SV1.19 51.2,47.04 51.2,47.05 51.2,60.25 47.95,63.5
N$1
  Bottom 0.305: U$1.19 72.9,81.35 72.8,81.45 | U$1.20 72.4,81.85 72.5,81.75
  Bottom 0.61: L2.1 67.35,82.8 C10.1 69.5,82.45 70.1,81.75 72.5,81.75 72.8,81.45
N$2
  Bottom 0.254: U$1.21 71.45,82.35 C10.2
N$3  (via drill 0.5)
  Top 0.61: 84.4,8.75 84.4,35.25 82.05,37.6 82.05,40.45 81.45,41.05 80.15,41.05 79.4,41.8 79.4,45.05 80.2,45.85 v80.2,47.1 | v80.7,1.45 84.4,5.15 84.4,8.75 | 84.3,8.75 v83.35,8.75 84.4,8.75
  Bottom 0.254: C15.1 76.05,78.75 76.6,79.3 76.9,79.3 77,79.3 U$1.13 | U$1.14 76.5,79.75
  Bottom 0.305: 76.5,79.75 76.5,79.7 76.9,79.3
  Bottom 0.406: TP1.TP 83.35,9.55 v83.35,8.75
  Bottom 0.61: X1.1 81.34,1.45 v80.7,1.45 | v80.2,47.1 80.1,47.3 80.15,54.05 80.85,54.75 81.8,54.75 83.1,56.05 83.1,77.75 82.25,78.6 81.3,78.6 80.6,79.3 77,79.3
N$4
  Bottom 0.61: LED1.A R12.2
N$5
  Bottom 0.254: U$1.22 72.55,82.85 C12.1
N$6
  Bottom 0.254: 81.15,80.3 R26.1 | R26.1 81.55,79.8 82,79.35 83.4,79.35 83.85,78.9 83.8,57.7 83.8,54.95 84.5,54.25 84.5,40.33 R7.1 | U$1.11 79.7,81.85 R26.1
N$7
  Bottom 0.254: U$1.10 80.85,82.35 R8.1
N$8
  Bottom 0.254: U$1.23 72.7,83.35 71.75,84.3 71.75,85.25 C17.1
N$9  (via drill 0.5)
  Top 0.254: v63.8,94.7 75.05,94.7 77.55,92.2 77.55,88.55 v76.45,87.5
  Bottom 0.254: U$1.4 76,87.05 v76.45,87.5 | v63.8,94.7 LED1.C
N$11
  Bottom 0.254: U$5.1 67.69,57.6 68.7,56.6 72.95,56.6 73.85,55.75 73.85,53.45 74.1,53.2 77.05,53.2 Q3.1
N$12
  Bottom 0.61: R18.1 R19.1 R20.1 R21.1 R22.1 R23.1 33.6,48 Q1.2
N$13
  Bottom 0.254: U$5.2 68.97,57.38 69.3,57.05 73.39,57.05 75.2,55.34 Q3.4
N$15
  Bottom 0.254: 80.95,83.95 R27.2 79.65,82.85 U$1.9
N$16
  Bottom 0.61: C21.1 28.05,71.85 R38.2 D4.A
N$17
  Bottom 0.254: U$1.8 79.1,83.35 80.2,84.45 80.2,85.1 81.15,86.05 R28.2
N$19
  Bottom 0.254: U$8.17 39.68,90.05 Q2.4 40.6,91.42 C24.2
N$20
  Bottom 0.61: Q1.1 39.6,49.7 R24.1
N$21  (via drill 0.5)
  Top 0.254: v39.35,93.8 39.05,94.05 30.75,94.05 29.75,93.05 29.75,88.2 v30.9,87.05
  Bottom 0.254: 40.58,94.5 Q2.1 39.78,93.25 39.35,93.25 | C8.1 39.35,93.25 | v39.35,93.8 39.35,93.25 | U$8.9 32.8,89.55 32,88.75 32,87.45 31.6,87.05 v30.9,87.05
N$22  (via drill 0.5)
  Top 0.254: v32.25,90.15 32.3,90.2 38,90.2 v38.8,91
  Bottom 0.254: U$8.16 38.37,90.57 v38.8,91 | C25.2 v32.25,90.15
N$23  (via drill 0.5)
  Top 0.254: v37.35,91.6 34.95,91.6 34.55,91.2 33.2,91.2 32.85,91.55 31.45,91.55 30.9,91 30.9,89.2 v31.1,89
  Bottom 0.254: C26.2 v31.1,89 | v37.35,91.6 37.1,91.35 U$8.15
N$24
  Bottom 0.254: U$8.5 35.6,85.95 35.75,85.8 35.75,84.6 36.05,84.3 37.55,84.3 R11.2 38.7,86.4 39.45,87.1 D2.A
N$25  (via drill 0.5)
  Top 0.254: ANTENNA.MP 28.2,87.05 29.6,85.65 v36.65,85.65
  Bottom 0.254: L3.2 28.2,91 ANTENNA.MP | U$8.4 36.1,86.2 v36.65,85.65
N$26
  Bottom 0.254: R29.2 37.9,83.35 37.6,83.65 35.75,83.65 35.25,84.15 35.25,85.5 35.08,85.67 U$8.6
N$30
  Bottom 0.406: D5.A 65.8,90.03 65.8,91.55 64.75,92.6 R39.1
OUT1_IN2
  Bottom 0.406: U$3.3 23.45,67.85 U$10.1
OUT2
  Bottom 0.254: 25.6,63.1 25.6,62.5 C23.2
  Bottom 0.305: U$10.3 25.6,63.1
P_CLK
  Bottom 0.254: R16.2 39.25,73.5 41.25,75.5 X5.12
PWM  (via drill 0.5)
  Top 0.254: v55.35,53.5 54.7,53.5 54.1,54.1 47.6,54.1 45.2,51.7 41.5,51.7 40.5,50.7 40.5,48 v42.4,46.1
  Bottom 0.254: SV1.11 62.35,46.05 62.35,52.2 60.55,54 55.85,54 v55.35,53.5 | v42.4,46.1 R25.2
  Bottom 0.61: R24.2 R25.2
RANDOM
  Bottom 0.254: 34.6,45.15 33.15,46.6 22.75,46.6 22,47.35 22.05,60.71 22.72,61.13
  Bottom 0.305: C23.1 22.72,61.13 | 34.6,45.15 34.6,43.85 35.25,43.2 37.26,43.2 SV1.32
ROW0  (via drill 0.5)
  Top 0.254: SHILFT-LEFT.OUT 9.12,6.75 8.2,6.75 6.85,8.1 6.85,10.35 arc90 7.4,10.9 7.4,11.65 arc90 Z.OUT Z.OUT arc-90 5.4,13.64 5.4,16.4 arc-90 3.4,18.4 3.4,18.55 arc-90 5.3,20.45 A.OUT arc-90 5.4,20.48 5.4,23.35 arc-90 3.45,25.3 3.45,25.4 arc-90 5.34,27.29 Q.OUT arc90 5.45,27.3 5.45,31.65 | 1.OUT 1.OUT arc90 3.5,33.6 arc90 5.45,31.65 | v7.6,31.6 7.55,31.65 5.45,31.65
  Bottom 0.254: U$7.15 72.9,26.6 12.6,26.6 v7.6,31.6
ROW1  (via drill 0.5)
  Top 0.254: 2.OUT 12.73,35.53 arc90 10.85,33.65 10.85,33.55 arc90 12.85,31.55 | 12.85,31.55 W.OUT arc90 W.OUT 12.74,27.29 arc90 10.85,25.4 10.85,25.35 arc90 12.9,23.3 12.9,20.5 arc-90 S.OUT 12.75,20.45 arc90 10.85,18.55 10.85,18.45 arc90 12.85,16.45 X.OUT arc90 X.OUT | v14.85,31.45 14.75,31.55 12.85,31.55
  Bottom 0.254: U$7.16 72.65,27.05 19.25,27.05 v14.85,31.45
ROW2  (via drill 0.5)
  Top 0.254: SPACE1.OUT 20.25,8.02 20.25,9.65 arc90 22.2,11.6 22.2,11.75 arc90 20.34,13.61 C.OUT arc90 20.3,13.64 20.3,16.55 arc-90 18.3,18.55 arc-90 20.2,20.45 D.OUT arc-90 20.25,20.46 20.25,23.3 arc-90 18.25,25.3 18.25,25.4 arc-90 20.14,27.29 E.OUT arc-90 20.25,27.3 20.25,31.55 | 3.OUT 20.18,35.53 arc90 18.3,33.65 18.3,33.5 arc90 20.25,31.55 | v22.45,31.55 20.25,31.55
  Bottom 0.254: U$7.17 72.39,27.5 26.5,27.5 v22.45,31.55
ROW3  (via drill 0.5)
  Top 0.254: 4.OUT 27.53,35.53 arc90 25.65,33.65 arc90 27.7,31.6 27.7,31.35 | 27.7,31.35 27.7,27.32 arc-90 R.OUT 27.59,27.29 arc90 25.7,25.4 25.7,25.2 arc90 27.65,23.25 27.65,20.48 arc90 F.OUT 27.6,20.45 arc90 25.7,18.55 25.7,18.45 arc90 27.65,16.5 27.65,13.63 arc90 V.OUT 27.79,13.61 arc-90 29.7,11.7 29.7,11.05 arc-90 29,10.35 29,8.3 30.55,6.75 31.36,6.75 SPACE2.OUT | v29.85,31.6 27.95,31.6 27.7,31.35
  Bottom 0.254: U$7.18 72.13,27.95 33.5,27.95 v29.85,31.6
ROW4  (via drill 0.5)
  Top 0.254: B.OUT arc90 B.OUT 35.2,16.5 arc-90 33.25,18.45 33.25,18.55 arc-90 35.15,20.45 G.OUT arc90 G.OUT 35.2,23.35 arc-90 33.3,25.25 33.3,25.4 arc-90 T.OUT T.OUT arc90 T.OUT 35.2,31.5 | 5.OUT 35.03,35.53 arc90 33.15,33.65 33.15,33.55 arc90 35.2,31.5 | v37.3,31.65 35.35,31.65 35.2,31.5
  Bottom 0.254: U$7.19 71.88,28.4 40.55,28.4 v37.3,31.65
ROW5  (via drill 0.5)
  Top 0.254: 6.OUT 42.48,35.53 arc90 40.55,33.6 40.55,33.45 arc90 42.5,31.5 | 42.5,31.5 Y.OUT arc90 Y.OUT 42.49,27.29 arc90 40.6,25.4 40.6,25.3 arc90 42.5,23.4 H.OUT arc90 H.OUT 42.4,20.45 arc90 40.45,18.5 40.45,18.45 arc90 42.5,16.4 N.OUT arc90 N.OUT 42.41,13.61 arc90 40.5,11.7 40.5,11.2 arc90 41.75,9.95 41.27,9.46 SPACE3.OUT | v44.75,31.6 42.6,31.6 42.5,31.5
  Bottom 0.254: U$7.20 71.62,28.85 47.5,28.85 v44.75,31.6
ROW6  (via drill 0.5)
  Top 0.254: SHIFT-RIGHT.OUT 53.6,6.75 52.65,6.75 51.35,8.05 51.35,10.25 arc90 52,10.9 52,11.7 arc90 50.09,13.61 M.OUT arc-90 49.95,13.62 49.95,16.5 arc-90 47.9,18.55 47.9,18.6 arc-90 49.75,20.45 J.OUT arc-90 49.95,20.46 49.95,23.4 arc-90 48,25.35 48,25.4 arc-90 49.89,27.29 U.OUT arc90 50,27.32 50,31.5 | 7.OUT 49.93,35.53 arc90 48,33.6 48,33.5 arc90 50,31.5 | v52.3,31.95 50.45,31.95 50,31.5
  Bottom 0.254: U$7.21 71.12,30.95 53.3,30.95 v52.3,31.95
ROW7  (via drill 0.5)
  Top 0.254: 8.OUT 57.23,35.53 arc90 55.3,33.6 55.3,33.5 arc90 57.3,31.5 | 57.3,31.5 57.3,27.32 arc90 I.OUT 57.19,27.29 arc90 55.3,25.4 arc90 57.35,23.35 57.35,20.48 arc-90 K.OUT 57.3,20.45 arc90 55.4,18.55 55.4,18.35 arc90 57.3,16.45 57.3,13.63 arc90 ?.OUT | v59.7,32.1 58.4,32.1 57.8,31.5 57.3,31.5
  Bottom 0.254: U$7.22 71.33,31.45 60.35,31.45 v59.7,32.1
ROW8  (via drill 0.5)
  Top 0.254: @.OUT arc90 64.75,6.79 64.75,9.65 arc-90 62.7,11.7 arc-90 64.61,13.61 !.OUT arc-90 64.7,13.64 64.7,16.5 arc-90 62.75,18.45 62.75,18.55 arc-90 64.65,20.45 L.OUT arc90 64.75,20.46 64.75,23.25 arc-90 62.7,25.3 62.7,25.35 arc-90 64.64,27.29 O.OUT arc90 64.75,27.3 64.75,31.5 | 9.OUT 64.63,35.53 arc90 62.7,33.6 62.7,33.55 arc90 64.75,31.5 | v66.3,32.3 65.95,32.3 65.35,31.5 64.75,31.5
  Bottom 0.254: U$7.23 71.53,31.95 66.65,31.95 v66.3,32.3
ROW9  (via drill 0.5)
  Top 0.254: (.OUT 72.1,20.45 arc90 70.2,18.55 70.2,18.5 arc90 72.2,16.5 72.2,13.65 arc-90 ,.OUT 72.34,13.61 arc-90 74.2,11.75 74.2,11.05 arc-90 73.45,10.3 73.45,8.35 75,6.8 75.83,6.8 FN-RIGHT.OUT | (.OUT arc90 (.OUT | 0.OUT 71.88,35.53 arc90 70.1,33.75 | 70.1,33.75 arc90 72.2,31.65 72.2,27.34 arc-90 P.OUT 72.04,27.29 arc90 70.15,25.4 70.15,25.35 arc90 72.15,23.35 72.16,23.34 (.OUT | v70.35,32.75 70.5,33.2 70.15,33.2 70.1,33.25 70.1,33.75
  Bottom 0.254: U$7.24 71.44,32.75 v70.35,32.75
ROW10  (via drill 0.5)
  Top 0.254: 79.55,27.3 arc90 +.OUT | +.OUT 79.49,27.29 arc90 77.6,25.4 77.6,25.35 arc90 79.6,23.35 79.6,20.48 arc-90 ).OUT ).OUT arc90 77.65,18.55 77.65,18.5 arc90 79.55,16.6 79.55,13.62 arc90 ..OUT | v78.1,36.7 79.27,35.53 -.OUT 79.48,35.53 arc90 77.6,33.65 77.6,33.55 arc90 79.55,31.6 78.75,31.6 78.75,27.29 +.OUT
  Bottom 0.254: U$7.25 72.65,32.25 72.65,33.3 75.95,36.7 v78.1,36.7
SCK
  Top 0.254: 48.59,45.75 SV1.23 48.59,47.39 49.6,48.4 53.7,48.4 58.85,53.55 62.2,53.55 63.25,54.6 63.25,68.5 69.92,75.17 SV3.16
  Bottom 0.254: 50.6,57.6 50.6,57.8 44.9,63.5 X5.36
  Bottom 0.305: 50.6,57.6 50.6,50.9 48.59,48.89 SV1.23
SCL_3V3  (via drill 0.5)
  Top 0.254: v69.7,22.45 69.7,23.2 68.5,24.4 68.5,34.5 v70.95,36.95 | v31.8,58.75 30.15,60.4 30.15,70.45 34.9,75.2 | v34.8,76.8 34.8,75.2 34.9,75.2 | v36.6,82.7 38.7,84.8 38.7,87.15 38.15,87.7 v34.05,87.7 | v70.45,47.85 70.45,48.85 73.25,51.65 73.25,61.6 74.12,62.47 SV3.6 | 34.9,75.2 41.25,75.2 53.85,87.8 70.2,87.8 71.8,86.2 77.45,86.2 v77.85,86.6 78.45,87.2 80.6,87.2 81.3,86.5 81.3,82.95 79.65,81.3 72.75,81.3 v71.75,80.3 | v33.3,54.7 36,52 SCL.TP
  Bottom 0.254: 30.2,57.7 R6.1 30.55,58.25 31.8,58.25 | U$1.5 76.5,86.35 R10.2 v77.85,86.6 | U$7.11 74.1,24.97 74.1,24.4 72.9,23.2 70.45,23.2 v69.7,22.45 | v70.95,36.95 69.4,38.5 69.4,40.75 70.15,41.5 70.15,43.27 SV1.5 | 34.7,88.55 U$8.7 34.55,88.55 34.05,88.05 v34.05,87.7 | v34.8,76.8 34.8,80.9 v36.6,82.7 | v70.45,47.85 69.85,47.85 | SV3.6 75.6,64.15 75.6,72.35 71.35,76.6 71.35,79.75 71.8,80.2 v71.75,80.3 | U$6.12 34.08,57.67 33.5,58.25 31.8,58.25 | v31.8,58.75 31.8,58.25
  Bottom 0.305: U$5.6 70.23,50.98 R1.1 69.85,47.85 69.85,46.17 SV1.5 | U$6.12 34.08,55.58 v33.3,54.7
SDA_3V3  (via drill 0.5)
  Top 0.254: v80.75,28.3 v83.25,30.8 | v35.35,54.65 33.85,56.15 31.75,56.15 31.05,55.45 31.05,53.9 32.1,52.85 32.1,50.1 32.2,50 SDA.TP | 80.95,61.2 80.95,56.55 79.2,54.8 79.2,53.85 77.4,52.05 77.4,50.6 73.99,47.19 SV1.3 | 80.95,61.2 80.95,61.65 82.75,63.45 82.75,80.45 83.35,81.05 83.35,88.2 81.1,90.45 79.35,90.45 78.9,90 78.9,89.01 v79.8,88.11 | 80.95,61.2 78.55,61.2 SV3.4 | 78.7,85.1 v78.75,85.05 78.05,84.35 71.8,84.35 69.4,86.75 54.35,86.75 38.9,71.3 34.8,71.3 33.45,69.95 v33.45,68.7 33.45,62.4 v31.7,60.65
  Bottom 0.254: U$6.11 34.73,57.77 32.7,59.8 31.7,59.8 | 31.7,59.8 R2.1 | v31.7,60.65 31.7,59.8 | U$1.6 78.3,84.6 v78.75,85.05 78.75,87.06 v79.8,88.11 80.09,88.4 R9.2 | U$7.10 76.67,25.4 78.45,25.4 80.75,27.75 v80.75,28.3 | v83.25,30.8 83.15,33.6 78.85,37.9 75.8,37.9 74.95,37.1 73.35,37.1 72.7,37.75 72.75,43.33 SV1.3 72.1,46.46 72.1,48.2 71.25,49.05 R3.1 | v33.45,68.7 33.45,81.7 31.45,83.7 31.45,85.8 32.9,87.25 32.9,88.3 33.65,89.05 U$8.8
  Bottom 0.305: U$5.5 71.5,50.01 R3.1 | U$6.11 34.73,55.27 v35.35,54.65
STEPUP_ENABLE
  Bottom 0.254: U$2.1 27.1,78.7 25.5,78.7 25.1,79.1 25.1,81.3 24.55,81.85 22.15,81.85 21.5,81.2 21.5,47.2 22.6,46.1 31.6,46.1 32.1,45.6
  Bottom 0.305: SV1.31 39.7,43.3 39.7,41.35 39.05,40.7 35.3,40.7 34.6,41.4 34.6,42.7 34.05,43.25 32.65,43.25 32.1,43.8 32.1,45.6
TOUCH_X+
  Bottom 0.254: U$6.2 32.1,62.24 32.1,63.05 32.85,63.8 36.95,63.8 38.2,62.55 C2.2 39.45,61 40.8,61 41.8,62 X5.39
TOUCH_X-
  Bottom 0.254: U$6.4 33.45,62.19 33.45,61.2 33.85,60.8 35.25,60.8 36.65,59.4 38.65,59.4 39.7,58.35 C18.2 39.7,58.6 42.1,61 X5.41
TOUCH_Y+
  Bottom 0.254: U$6.3 32.77,60.38 35.9,57.25 37.05,57.25 37.6,57.8 38.5,57.8 | C3.2 38.5,57.8 | 38.5,57.8 40.2,57.8 42.9,60.5 X5.42
TOUCH_Y-
  Bottom 0.254: U$6.5 34.08,61.52 34.3,61.3 36.1,61.3 36.3,61.1 38.4,61.1 C4.2 40.65,60.2 41.95,61.5 X5.40
UART_RX
  Top 0.254: SV3.3 78.5,58.61 78.5,56.8 75.85,54.15 75.85,51.35 70.95,46.45 68.85,46.45 67.7,45.3 67.7,44.15 66.37,42.82 SV1.10
UART_TX
  Top 0.254: SV1.8 68.91,42.81 70.15,44.05 70.15,45.25 70.8,45.9 71.55,45.9 76.55,50.9 76.55,53 78,54.45 78,55.57 SV3.1
V+  (via drill 0.5)  (1 unrouted)
  Top 0.254: VCC.TP 49.55,51.55 53.2,51.55 v53.7,51.05
  Bottom 0.305: 56.21,45.44 55,46.65 53.35,46.65 52.4,47.6 52.4,49.6 52.75,49.95 R5.2
  Bottom 0.406: v53.7,51.05 C5.1 53.7,51.85 53.5,51.65 R5.2 R4.2 57.16,51.6 IC2.8
V_SYNC
  Bottom 0.254: X5.10 39.15,76.5 R14.1
VBAT+
  Bottom 0.61: U$5.3 70.23,61.88 U$4.+
VBUS
  Bottom 0.254: U$1.24 73.25,83.85 | U$1.1 74.4,84.55
  Bottom 0.406: C16.1 71.05,87.65 | U$9.1_+5V 72.7,91.1 72.35,90.75 | 72.55,84.55 72.55,84.85 | 74.4,84.55 72.55,84.55 | 73.25,83.85 72.55,84.55
  Bottom 0.813: 72.35,90.75 71,89.4 C16.1 | 71.05,87.65 72.55,86.15 72.55,84.85
VCC  (via drill 0.5)
  Top 0.254: v74.25,38.45 78.35,38.45 80,36.8 81.05,36.8 82.9,34.9 82.9,32.2 80.6,29.95 v80.35,29.95
  Bottom 0.254: U$7.38 79.12,31.4 79.35,31.4 79.58,31.18 | 79.58,31.18 80.35,30.4 v80.35,29.95 | v74.25,38.45 75.25,39.5 75.25,43.29 SV1.1 75.2,45.9 74.1,45.9 72.95,47.05 R3.2 74.25,49.6 75.35,50.7 75.35,51.6 74.5,52.45 73.9,52.45 73.4,52.95 73.4,55.5 72.85,56.05 72.25,56.05 68.8,56 67.7,54.9 67.7,54.4 | U$7.39 79.58,31.15 79.58,31.18
  Bottom 0.305: 73,49.7 R3.2 | C1.1 67.91,50.76 R1.2 | 67.7,54.4 U$5.8
  Bottom 0.61: R1.2 67.69,51.66 U$5.8

## Text on the board
tPlace: CrackberryPi / v1.0.4
bPlace: CrackberryPi / v1.0.4
tNames: 20.5,0
bNames: SFH482 | 30R | LED | ZLDO / 1117 / G33TA | 30R | uUSB-B | 10K | 1K | CM322522 / 8.2uH | 3x 4.7uF | BC847 | 4.7uF | BQ24297 | 4.7uF | 4.7uF | 3x 10K | 317R | CM322522 8.2uH | BAT54W | 47pF | 1.3M | NCP1406 | 10uF | 10K | 4.7uF | 5x 10K | 110K | 10mF | 470pF | 30R | BZT52B12 / 12V Zener | 0.1uF | BAT-HLD-012 / CR1216 | 609-1202-1-ND / ZIF-50 | 2x MAX2650 | TSC2007 | 4x 0.1uF | 470pF | 10K | 10K | MCP7940 | CM200C / 32.768kHz | 0.1uF | 0.1uF | CAT24C32 | 6x 147R | IRLML5203 / MOSFET | 1uF | 10K | TSOP38238 | 10K | 10K | 45K | 2x 3.9K | 0.1uF | TCA8424